# Altium schematic sheet Sheet1.SchDoc
size A4; SheetNumber: 1; SheetTotal: 1
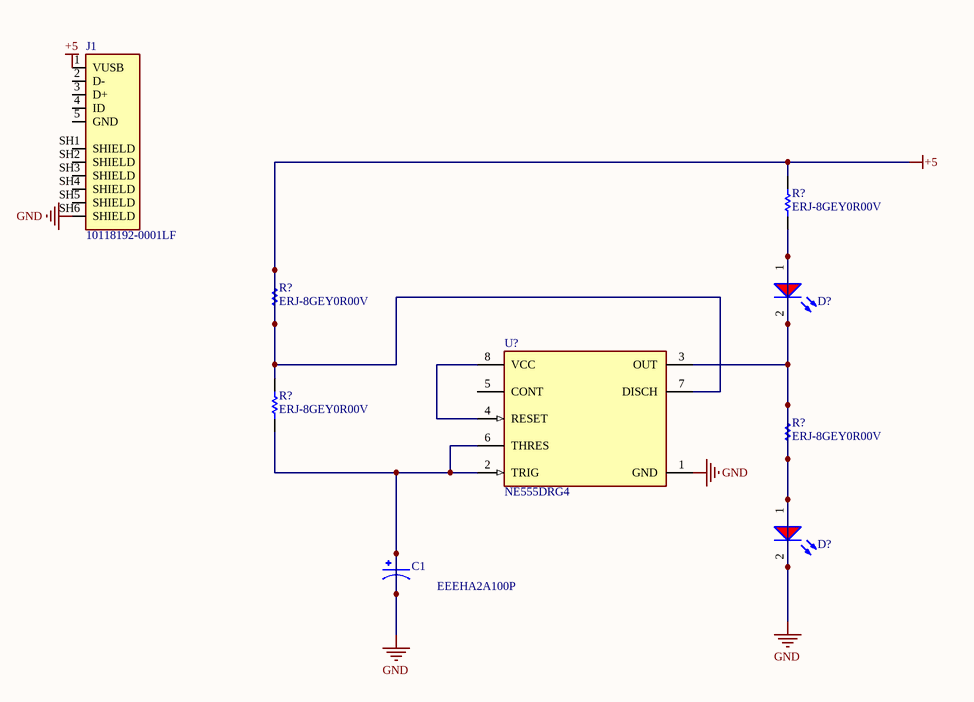
[diagram p0: Sheet1.SchDoc]

## Parts
(Parts that share a designator on the sheet are numbered #1, #2 ... from top to bottom, then left to right.)
C1  EEEHA2A100P  [CAP_EEEHA2A100P]
D?#1  Super Red, 2V, 40°  [WL-TMRC_D3.95H5.3]  (value not drawn)
D?#2  Super Red, 2V, 40°  [WL-TMRC_D3.95H5.3]  (value not drawn)
J1  10118192-0001LF  [AMPHENOL_10118192-0001LF]
R?#1  ERJ-8GEY0R00V  [RESC3216X70X50NL05T20]
R?#2  ERJ-8GEY0R00V  [RESC3216X70X50NL05T20]
R?#3  ERJ-8GEY0R00V  [RESC3216X70X50NL05T20]
R?#4  ERJ-8GEY0R00V  [RESC3216X70X50NL05T20]
U?  NE555DRG4  [FP-D0008A-IPC_A]

## Nets
+5: J1.1(VUSB) R?#1.2 R?#2.1 R?#2.2 R?#3.2 U?.7(DISCH)
GND: C1.1 C1.2 D?#1.1(A) D?#1.2(K) D?#2.1(A) D?#2.2(K) J1.SH6(SHIELD) R?#1.1 R?#3.1 R?#4.1 R?#4.2 U?.1(GND) U?.2(TRIG) U?.3(OUT) U?.6(THRES)
NetU?_4: U?.4(RESET) U?.8(VCC)

Not connected (* = marked no-connect by the designer): J1 2(D-) 3(D+) 4(ID) 5(GND) SH1(SHIELD) SH2(SHIELD) SH3(SHIELD) SH4(SHIELD) SH5(SHIELD); U? 5(CONT)

## Library data of the parts
C1 = EEEHA2A100P: 10ÂµF 100V Aluminum Electrolytic Capacitors Radial, Can - SMD 1000 Hrs @ 105Â°C; MF: Panasonic Electronic; MP: EEE-HA2A100P; Purchase-URL: https://pricing.snapeda.com/search/part/EEE-HA2A100P/?ref=eda; Price: None; Availability: In Stock; SnapEDA_Link: https://www.snapeda.com/parts/EEE-HA2A100P/Panasonic+Electronic+Components/view-part/?ref=snap; Check_prices: https://www.snapeda.com/parts/EEE-HA2A100P/Panasonic+Electronic+Components/view-part/?ref=eda; Package: RADIAL-2 Panasonic; Value: *
D?#1 D?#2 = 151031SS04000: WL-TMRC Mono-color Round Color, THT, D3.95 x H5.3mm, Super Red, 2V, 40°; Manufacturer: Wurth Elektronik; Case/Size Code: 3mm; Chip Technology: AlInGaP; Dominant Wavelength: 635nm; Luminous Intensity: 160mcd; Peak Wavelength: 640nm; Manufacturer Part Number: 151031SS04000; Category: Signal LEDs; Match Code: WL-TMRC; ComponentLink1Description: Website Link; ComponentLink1URL: https://www.we-online.com/redexpert/article/151031SS04000?ad; ComponentLink2Description: Datasheet Link; ComponentLink2URL: https://www.we-online.com/redexpert/spec/151031SS04000?ad; Mount: Through Hole; Operating Temperature Max: 85°C; Operating Temperature Min: -40°C; Packaging: Bulk; Height: 5.3mm; Diameter: 3.95mm; Emitting Color: Super Red; Forward Voltage: 2V; Viewing Angle: 40°
J1 = 10118192-0001LF: Micro USB, Input Output Connectors, B TYPE RECEPTACLE with flange; MF: Amphenol ICC; Check_prices: https://www.snapeda.com/parts/10118192-0001LF/Amphenol+FCI/view-part/?ref=eda; Value: *; Availability: In Stock; MP: 10118192-0001LF; Price: None; Package: None; Purchase-URL: https://pricing.snapeda.com/search/part/10118192-0001LF/?ref=eda; SnapEDA_Link: https://www.snapeda.com/parts/10118192-0001LF/Amphenol+FCI/view-part/?ref=snap
R?#1-R?#4 = CMP-2003-00541-1: Manufacturer: Panasonic; Part Number: ERJ-8GEY0R00V
U? = CMP-04858-000027-1: IC OSC SGL TIMER 100KHZ 8-SOIC; Number of Timers/Counters: 1; Min Supply Voltage: 4.5V; Quiescent Current: 15mA; Nominal Supply Current: 2mA; Max Supply Voltage: 16V; Low Level Output Current: 200mA; Operating Supply Current: 10mA; High Level Output Current: -200mA; Height: 1.58mm; Max Operating Temperature: 70°C; Case/Package: SOIC; Package Quantity: 2500; RoHS Compliant: Yes; Min Operating Temperature: 0°C; Frequency: 100kHz; Width: 3.91mm; Mount: Surface Mount; Number of Pins: 8; Packaging: Tape and Reel; Supply Current: 2mA; Length: 4.9mm; Series: -; Weight: 0.002561oz; Radiation Hardening: No; Lead Free: Lead Free